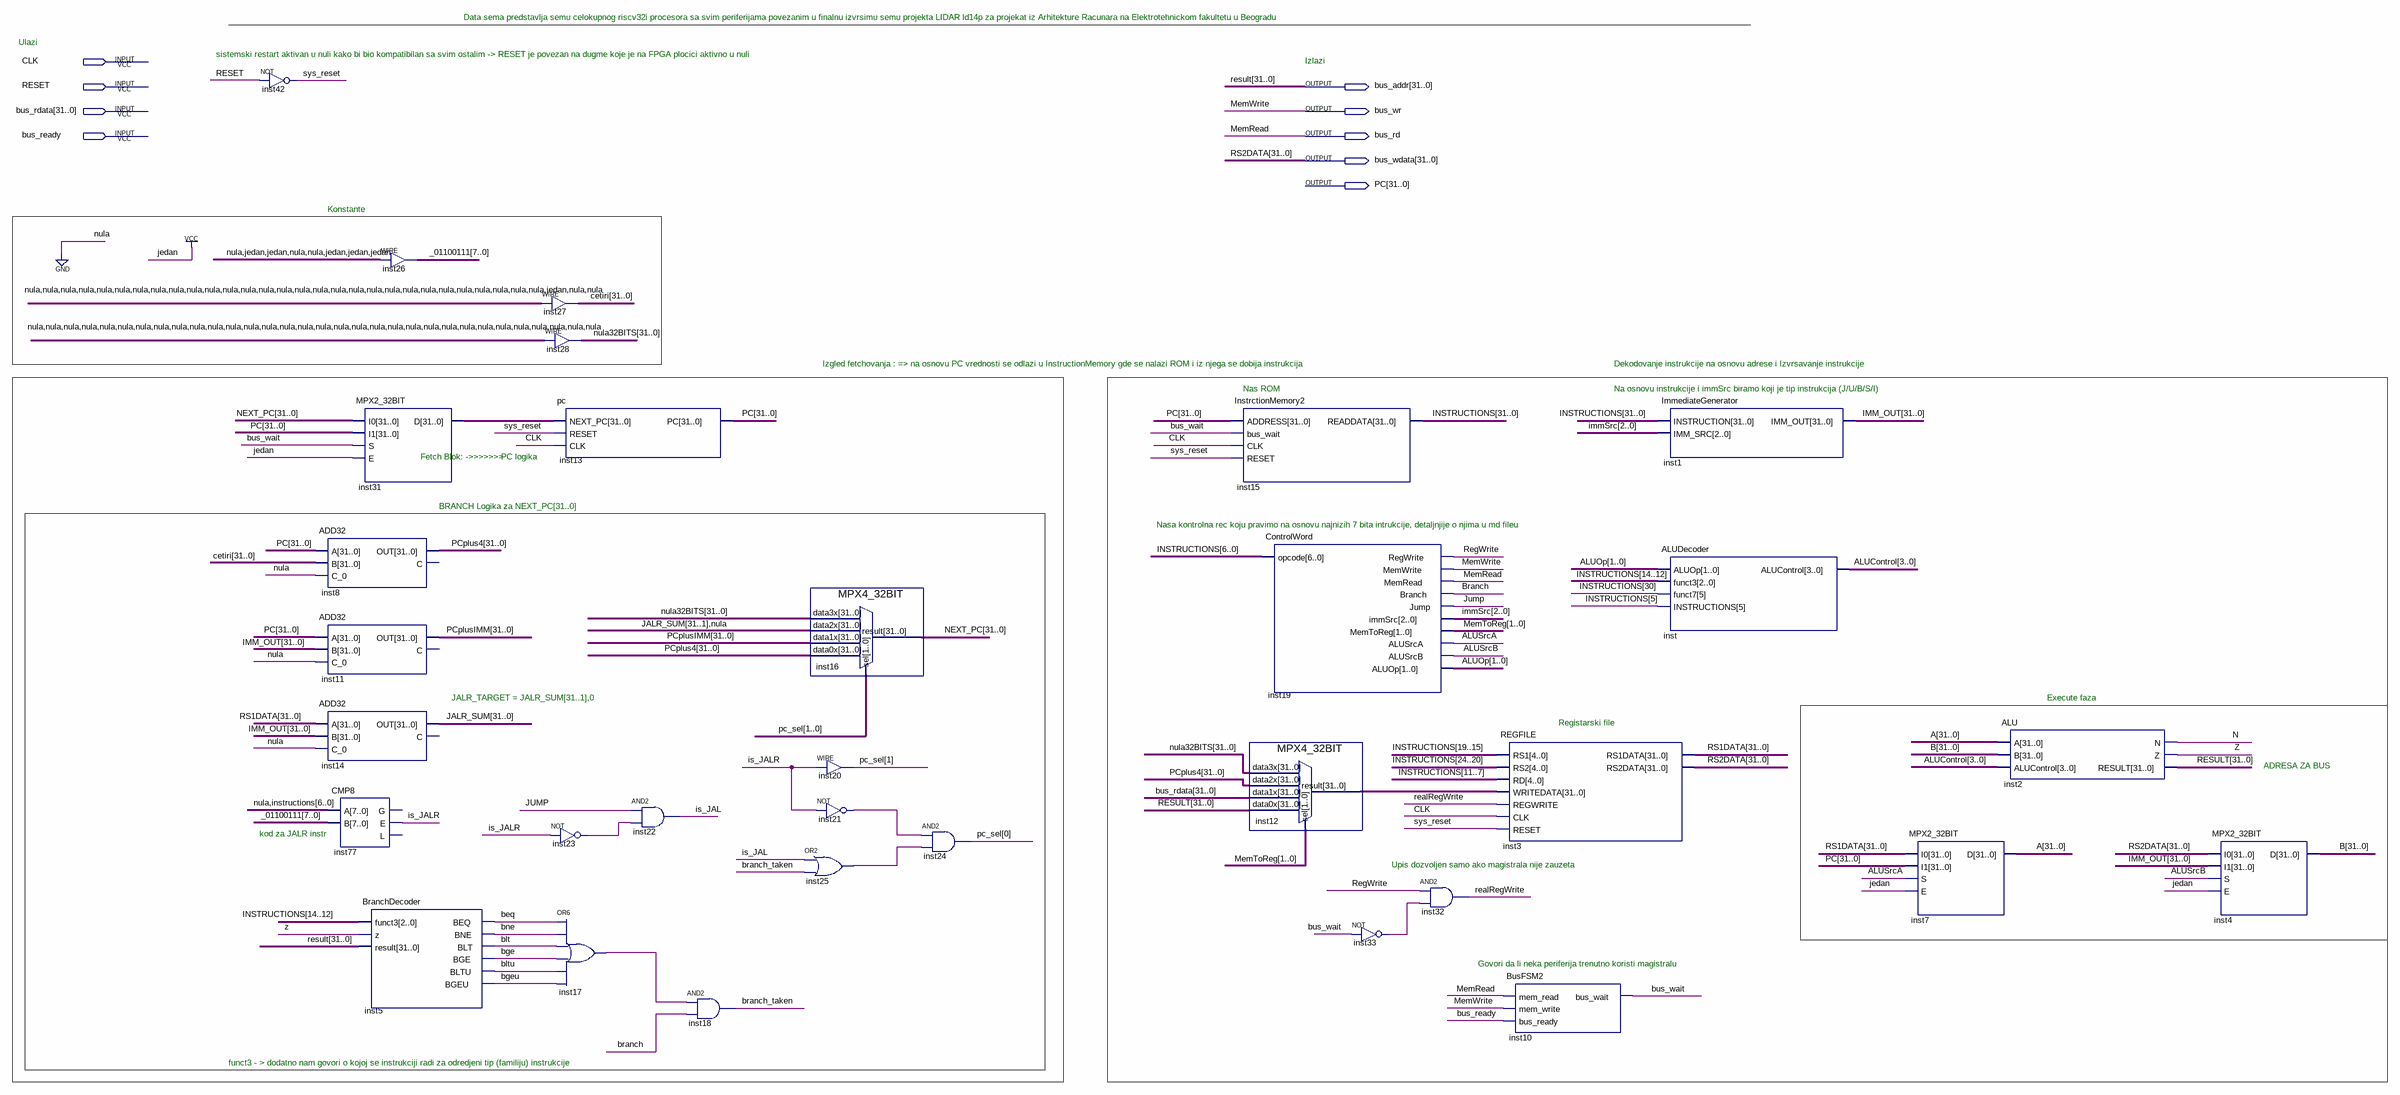
[diagram p0: schematic sheet]
// Quartus schematic riscv32iTest.bdf as structural Verilog: 32 symbols, 9 pins
module riscv32iTest (
  input  CLK,
  input  RESET,
  input  [31:0] bus_rdata,
  input  bus_ready,
  output [31:0] bus_addr,
  output bus_wr,
  output bus_rd,
  output [31:0] bus_wdata,
  output [31:0] PC
);

  wire ALUSrcA, ALUSrcB, beq, bge, bgeu, blt, bltu, bne, Branch, branch_taken, bus_wait, inst17_out,
       inst21_out, inst23_out, inst25_out, inst33_out, is_JAL, is_JALR, JUMP, N, realRegWrite, RegWrite,
       sys_reset, Z;
  wire [1:0] ALUOp, MemToReg, pc_sel;
  wire [2:0] immSrc;
  wire [3:0] ALUControl;
  wire [7:0] _01100111;
  wire [31:0] A, B, cetiri, IMM_OUT, inst12_result, inst31_d, INSTRUCTIONS, JALR_SUM, NEXT_PC, nula32BITS,
       PCplus4, PCplusIMM, RS1DATA;

  not inst42 (sys_reset, RESET);
  ADD32 inst8 (.A(PC), .B(cetiri), .C_0(1'b0), .OUT(PCplus4));  // open: C
  ADD32 inst11 (.A(PC), .B(IMM_OUT), .C_0(1'b0), .OUT(PCplusIMM));  // open: C
  ADD32 inst14 (.A(RS1DATA), .B(IMM_OUT), .C_0(1'b0), .OUT(JALR_SUM));  // open: C
  CMP8 inst77 (.A({1'b0, INSTRUCTIONS[6:0]}), .B(_01100111), .E(is_JALR));  // open: G, L
  assign _01100111 = 8'b01100111;  // WIRE inst26
  MPX2_32BIT inst31 (.I0(NEXT_PC), .I1(PC), .S(bus_wait), .E(1'b1), .D(inst31_d));
  BranchDecoder inst5 (
    .funct3(INSTRUCTIONS[14:12]), .z(Z), .result(bus_addr), .BEQ(beq), .BNE(bne), .BLT(blt), .BGE(bge),
    .BLTU(bltu), .BGEU(bgeu));
  assign cetiri = 32'b00000000000000000000000000000100;  // WIRE inst27
  assign nula32BITS = {32{1'b0}};  // WIRE inst28
  pc inst13 (.NEXT_PC(inst31_d), .RESET(sys_reset), .CLK(CLK), .PC(PC));
  not inst23 (inst23_out, is_JALR);
  or inst17 (inst17_out, beq, bne, blt, bge, bltu, bgeu);
  and inst22 (is_JAL, JUMP, inst23_out);
  and inst18 (branch_taken, inst17_out, Branch);
  MPX4_32BIT inst16 (
    .data3x(nula32BITS), .data2x({JALR_SUM[31:1], 1'b0}), .data1x(PCplusIMM), .data0x(PCplus4), .sel(pc_sel),
    .result(NEXT_PC));
  assign pc_sel[1] = is_JALR;  // WIRE inst20
  not inst21 (inst21_out, is_JALR);
  or inst25 (inst25_out, is_JAL, branch_taken);
  and inst24 (pc_sel[0], inst21_out, inst25_out);
  InstrctionMemory2 inst15 (.ADDRESS(PC), .bus_wait(bus_wait), .CLK(CLK), .RESET(sys_reset), .READDATA(INSTRUCTIONS));
  ControlWord inst19 (
    .opcode(INSTRUCTIONS[6:0]), .RegWrite(RegWrite), .MemWrite(bus_wr), .MemRead(bus_rd), .Branch(Branch),
    .Jump(JUMP), .immSrc(immSrc), .MemToReg(MemToReg), .ALUSrcA(ALUSrcA), .ALUSrcB(ALUSrcB), .ALUOp(ALUOp));
  MPX4_32BIT inst12 (
    .data3x(nula32BITS), .data2x(PCplus4), .data1x(bus_rdata), .data0x(bus_addr), .sel(MemToReg),
    .result(inst12_result));
  not inst33 (inst33_out, bus_wait);
  and inst32 (realRegWrite, RegWrite, inst33_out);
  REGFILE inst3 (
    .RS1(INSTRUCTIONS[19:15]), .RS2(INSTRUCTIONS[24:20]), .RD(INSTRUCTIONS[11:7]), .WRITEDATA(inst12_result),
    .REGWRITE(realRegWrite), .CLK(CLK), .RESET(sys_reset), .RS1DATA(RS1DATA), .RS2DATA(bus_wdata));
  BusFSM2 inst10 (.mem_read(bus_rd), .mem_write(bus_wr), .bus_ready(bus_ready), .bus_wait(bus_wait));
  ImmediateGenerator inst1 (.INSTRUCTION(INSTRUCTIONS), .IMM_SRC(immSrc), .IMM_OUT(IMM_OUT));
  ALUDecoder inst (
    .ALUOp(ALUOp), .funct3(INSTRUCTIONS[14:12]), .funct7(INSTRUCTIONS[30]), .INSTRUCTIONS(INSTRUCTIONS[5]),
    .ALUControl(ALUControl));
  MPX2_32BIT inst7 (.I0(RS1DATA), .I1(PC), .S(ALUSrcA), .E(1'b1), .D(A));
  ALU inst2 (.A(A), .B(B), .ALUControl(ALUControl), .N(N), .Z(Z), .RESULT(bus_addr));
  MPX2_32BIT inst4 (.I0(bus_wdata), .I1(IMM_OUT), .S(ALUSrcB), .E(1'b1), .D(B));

  // Other names for the same wires on the sheet: MemRead = bus_rd; MemWrite = bus_wr; RESULT[31:0] = bus_addr;
  //   RS2DATA[31:0] = bus_wdata

  // Notes on the sheet:
  //   Data sema predstavlja semu celokupnog riscv32i procesora sa svim periferijama povezanim u finalnu izvrsimu semu projekta LIDAR ld14p za projekat iz Arhitekture Racunara na Elektrotehnickom fakultetu u Beogradu
  //   Ulazi
  //   sistemski restart aktivan u nuli kako bi bio kompatibilan sa svim ostalim -> RESET je povezan na dugme koje je na FPGA plocici aktivno u nuli
  //   Izlazi
  //   Konstante
  //   Izgled fetchovanja : => na osnovu PC vrednosti se odlazi u InstructionMemory gde se nalazi ROM i iz njega se dobija instrukcija
  //   Dekodovanje instrukcije na osnovu adrese i Izvrsavanje instrukcije
  //   Nas ROM
  //   Na osnovu instrukcije i immSrc biramo koji je tip instrukcija (J/U/B/S/I)
  //   Fetch Blok: ->>>>>>>
  //   PC logika
  //   BRANCH Logika za NEXT_PC[31..0]
  //   Nasa kontrolna rec koju pravimo na osnovu najnizih 7 bita intrukcije, detaljnjije o njima u md fileu
  //   JALR_TARGET = JALR_SUM[31..1],0
  //   Execute faza
  //   Registarski file
  //   ADRESA ZA BUS
  //   kod za JALR instr
  //   Upis dozvoljen samo ako magistrala nije zauzeta
  //   Govori da li neka periferija trenutno koristi magistralu
  //   funct3 - > dodatno nam govori o kojoj se instrukciji radi za odredjeni tip (familiju) instrukcije
endmodule
